# Altium schematic sheet OpenPack_BATMOD_V2p0_BAT.SchDoc
size A4; SheetNumber: 6; SheetTotal: 9; Title_: Battery Manager
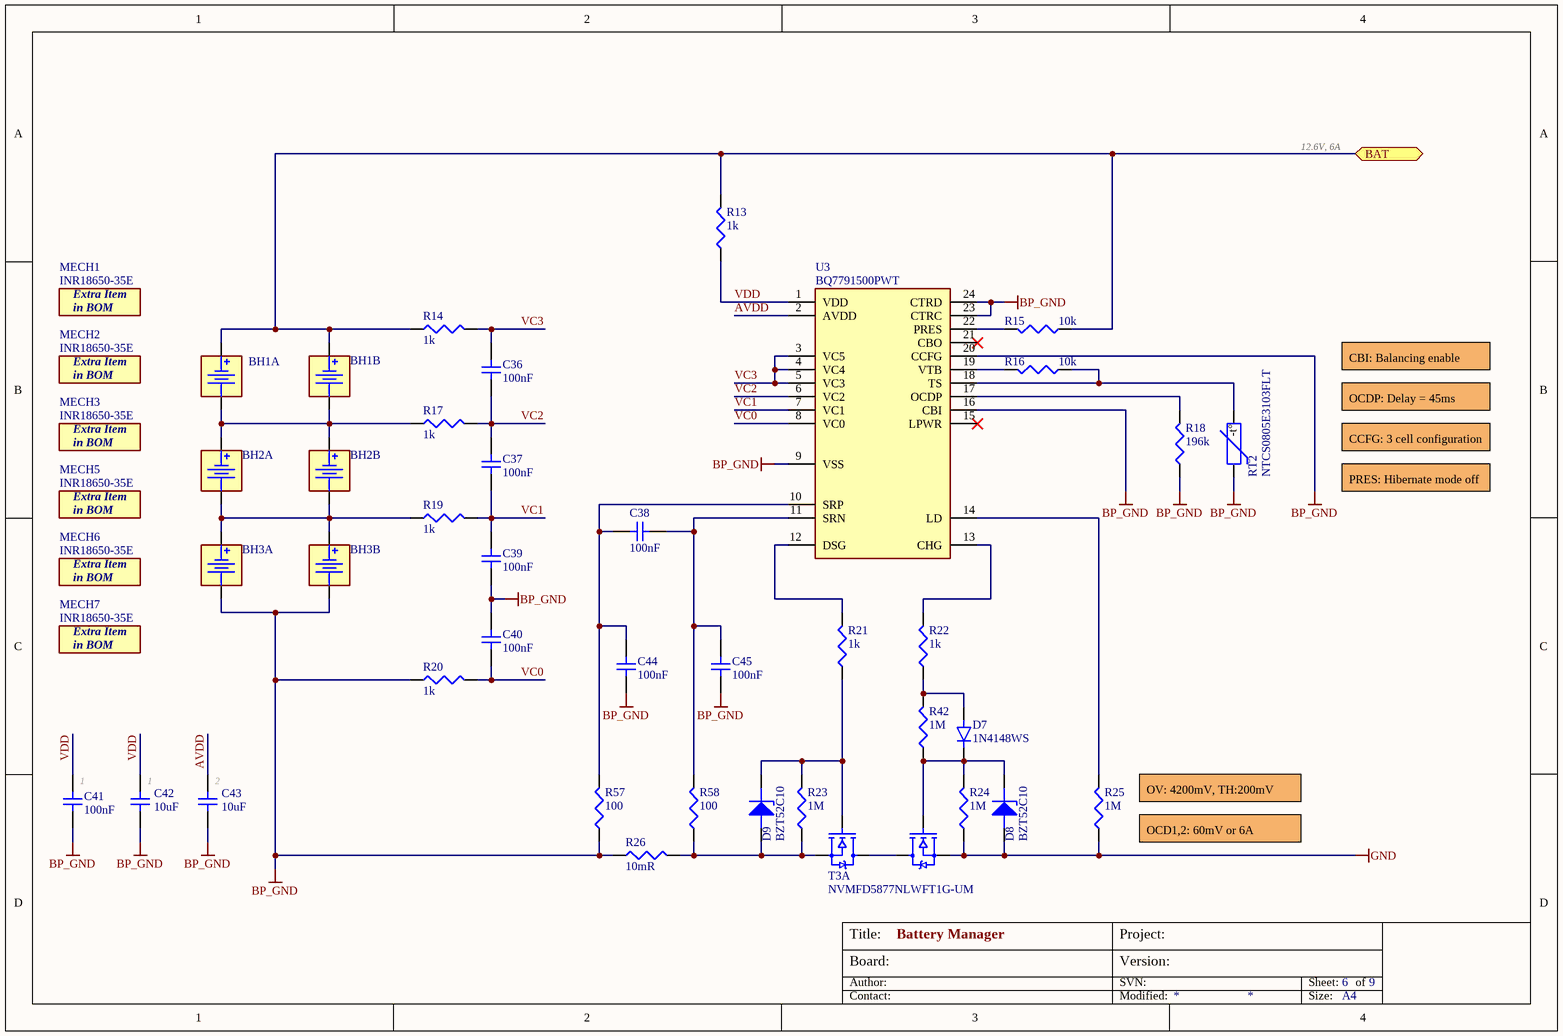
[diagram p0: OpenPack_BATMOD_V2p0_BAT.SchDoc]

## Parts
BH1  12BHC186P-GR  [12BHC186P-GR]  (value not drawn)  (parts A,B of 2)
BH2  12BHC186P-GR  [12BHC186P-GR]  (value not drawn)  (parts A,B of 2)
BH3  12BHC186P-GR  [12BHC186P-GR]  (value not drawn)  (parts A,B of 2)
C36  100nF  [CAP_0603]
C37  100nF  [CAP_0603]
C38  100nF  [CAP_0603]
C39  100nF  [CAP_0603]
C40  100nF  [CAP_0603]
C41  100nF  [CAP_0603]
C42  10uF  [CAP_1210]
C43  10uF  [CAP_1210]
C44  100nF  [CAP_0603]
C45  100nF  [CAP_0603]
D7  1N4148WS  [SOD-323]
D8  BZT52C10  [SOD-123F]
D9  BZT52C10  [SOD-123F]
MECH1  INR18650-35E  (mechanical)
MECH2  INR18650-35E  (mechanical)
MECH3  INR18650-35E  (mechanical)
MECH5  INR18650-35E  (mechanical)
MECH6  INR18650-35E  (mechanical)
MECH7  INR18650-35E  (mechanical)
R13  1k  [RES-0603]
R14  1k  [RES-0603]
R15  10k  [RES-0603]
R16  10k  [RES-0603]
R17  1k  [RES-0603]
R18  196k  [RES-0603]
R19  1k  [RES-0603]
R20  1k  [RES-0603]
R21  1k  [RES-0603]
R22  1k  [RES-0603]
R23  1M  [RES-0603]
R24  1M  [RES-0603]
R25  1M  [RES-0603]
R26  10mR  [RES-2512]
R42  1M  [RES-0603]
R57  100  [RES-0603]
R58  100  [RES-0603]
RT2  NTCS0805E3103FLT  [RES-0805]
T3  NVMFD5877NLWFT1G-UM  [SO-8FL (DFN8)]  (parts A,B of 2)
U3  BQ7791500PWT  [TSSOP24]

## Ports
BAT (bidir, see OpenPack_BATMOD_V2p0_MAIN, OpenPack_BATMOD_V2p0_CHRG)

## Nets
BP_GND: BH3.1 BH3.3 C39.1 C40.2 C41.1 C42.1 C43.1 C44.1 C45.1 R18.1 R20.1 R26.1 R57.1 RT2.1 U3.9(VSS) U3.16(CBI) U3.20(CCFG) U3.23(CTRC) U3.24(CTRD)
GND: D8.1(A) R24.1 R25.1 T3.3
AVDD: C43.2 U3.2(AVDD)
BAT: BH1.2 BH1.4 R13.2 R14.1 R15.1 ; port BAT
VC0: C40.1 R20.2 U3.8(VC0)
VC1: C37.1 C39.2 R19.2 U3.7(VC1)
VC2: C36.1 C37.2 R17.2 U3.6(VC2)
VC3: C36.2 R14.2 U3.3(VC5) U3.4(VC4) U3.5(VC3)
VDD: C41.2 C42.2 R13.1 U3.1(VDD)
NetBH1_1: BH1.1 BH1.3 BH2.2 BH2.4 R17.1
NetBH2_1: BH2.1 BH2.3 BH3.2 BH3.4 R19.1
NetC38_1: C38.1 C45.2 R58.2 U3.11(SRN)
NetC38_2: C38.2 C44.2 R57.2 U3.10(SRP)
NetD7_1: D7.1 R22.1 R42.2
NetD7_2: D7.2 D8.2(K) R24.2 R42.1 T3.4
NetD9_1: D9.1(A) R23.1 R26.2 R58.1 T3.1
NetD9_2: D9.2(K) R21.1 R23.2 T3.2
NetR15_2: R15.2 U3.22(PRES)
NetR16_1: R16.1 RT2.2 U3.18(TS)
NetR16_2: R16.2 U3.19(VTB)
NetR18_2: R18.2 U3.17(OCDP)
NetR21_2: R21.2 U3.12(DSG)
NetR22_2: R22.2 U3.13(CHG)
NetR25_2: R25.2 U3.14(LD)
NetT3_9: T3.9 T3.10

Not connected (* = marked no-connect by the designer): U3 15(LPWR)* 21(CBO)*

## Notes on the sheet
- 12.6V, 6A
- CBI: Balancing enable
- OCDP: Delay = 45ms
- CCFG: 3 cell configuration
- PRES: Hibernate mode off
- (near C41) 1
- (near C42) 1
- (near C43) 2
- (near R25) OV: 4200mV, TH:200mV
- (near R25) OCD1,2: 60mV or 6A
- Board:
- Author:
- Title:
- Project:
- SVN:
- Version:
- Sheet:
- of
- Contact:
- Modified:
- Size:
- A4
- (in symbol INR18650-35E) Extra Item; in BOM
- (in symbol NTCS0805E3103FLT) -t°

## Library data of the parts
BH1-BH3 = 12BHC186P-GR: Battery holder, 2x18650; Supplier: Mouser; Part number: 12BHC186P-GR; ComponentLink1Description: Order; Type: MECH; ComponentLink2Description: Datasheet; ComponentLink2URL: https://hu.mouser.com/en/ProductDetail/Eagle-Plastic-Devices/12BHC186P-GR?qs=AQlKX63v8Rv70Ee1H7gwgg%3D%3D
C36-C41 C44 C45 = NP-CAPACITOR: MLCC capacitor; Type: CAP
C42 C43 = NP-CAPACITOR: UMK325BJ106KM-P; Part number: 810-CGA6P1X7R1N106K2; Type: CAP; Supplier: Mouser
D7 = 1N4148WS: Small Signal Diode, 75V, 150mA; Part number: 2453269; ComponentLink1Description: Datasheet; ComponentLink1URL: ONSM-S-A0013042080-1.pdf; Supplier: Farnell; ComponentLink2Description: Order; ComponentLink2URL: https://hu.farnell.com/on-semiconductor/1n4148ws/diode-small-signal-75v-sod-323f/dp/2453269?ost=2453269; Type: Diode
D8 D9 = BZT52C10: Zener diode 10V 0.5W; Part number: 100.399.09; Supplier: Hestore; Type: Diode; ComponentLink1Description: Datasheet; ComponentLink1URL: BZT52C10_EN_10039909.pdf; ComponentLink2Description: Order; ComponentLink2URL: https://www.hestore.hu/prod_10039909.html
MECH1-MECH3 MECH5-MECH7 = INR18650-35E: Li-Ion Battery cell, 18650, 3.7V, 3400mAh; Part number: 100.496.87; Type: MECH; Supplier: Hestore; ComponentLink1Description: Datasheet; ComponentLink2Description: Order; ComponentLink2URL: https://www.hestore.hu/prod_10049687.html
R13-R26 R42 R57 R58 = RESISTOR: Metal Film Resistor; Type: RES
RT2 = NTCS0805E3103FLT: NTC (Negative Temperature Coefficient) Thermistors 10Kohms 1%; Part number: 594-NTCS0805E3103FLT; Supplier: Mouser; Type: RES; ComponentLink1Description: Datasheet; ComponentLink2Description: Order; ComponentLink2URL: https://hu.mouser.com/en/ProductDetail/Vishay-BC-Components/NTCS0805E3103FLT?qs=%2FWiulJ9oly4Pd4lidS66Yw%3D%3D
T3 = NVMFD5877NLWFT1G-UM: Power NMOSFET Dual, 60V, 17A, 36mΩ; Part number: 863-FD5877NLWFT1G-UM; Type: FET; ComponentLink1Description: Datasheet; Supplier: Mouser; ComponentLink2Description: Order; ComponentLink2URL: https://hu.mouser.com/en/ProductDetail/onsemi/NVMFD5877NLWFT1G-UM?qs=PBDs2xEllI96pZN4%2F5B02g%3D%3D
U3 = BQ7791500PWT: Battery Management 3-series to 5-series stackable; Part number: 595-BQ7791500PWR; ComponentLink1Description: Datasheet; Supplier: Mouser; ComponentLink2Description: Order; ComponentLink2URL: https://hu.mouser.com/en/ProductDetail/Texas-Instruments/BQ7791500PWR?qs=F5EMLAvA7IBs7uL7im8AUA%3D%3D; Type: IC